# EAGLE schematic AnalogEx_1RedLedFadeInFadeOutUSB (EAGLE 7.6.0)
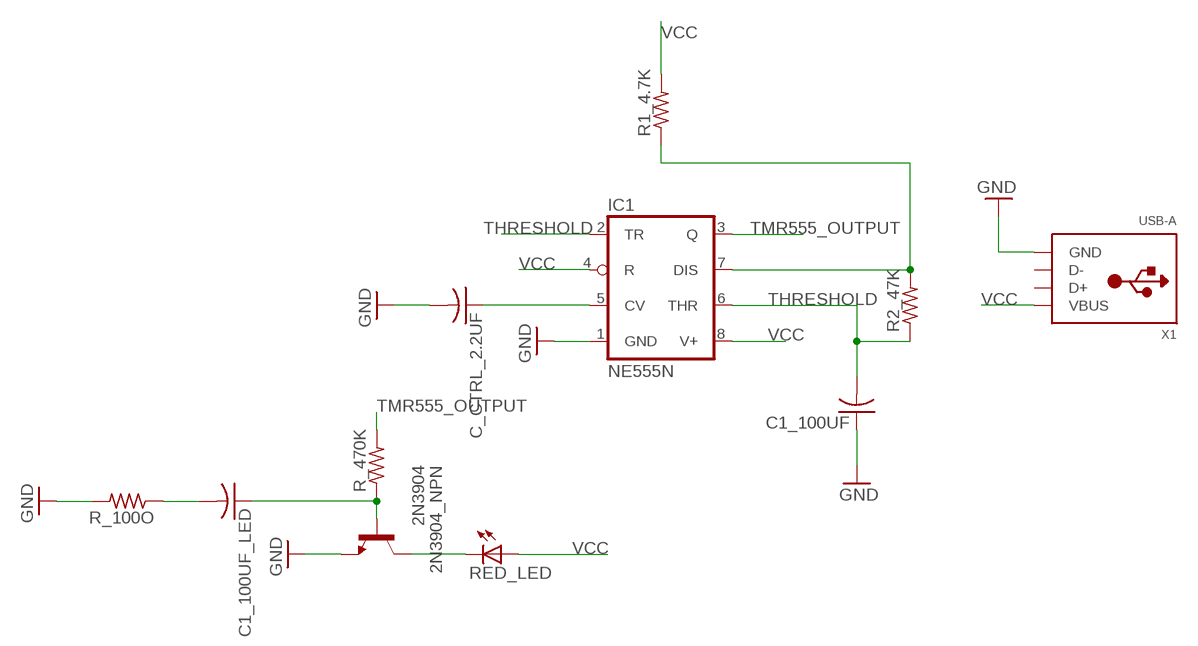
[diagram p0: schematic, sheet 1]

## Parts
2N3904_NPN  2N3904  [TO92]
C1_100UF  C-US025-030X050  [C025-030X050]
C1_100UF_LED  C-US025-030X050  [C025-030X050]
C_CTRL_2.2UF  C-US025-030X050  [C025-030X050]
IC1  NE555N  [DIL08]
R1_4.7K  R-US_0207/10  [0207/10]
R2_47K  R-US_0207/10  [0207/10]
R_100O  R-US_0207/10  [0207/10]
R_470K  R-US_0207/10  [0207/10]
RED_LED  LED5MM  [LED5MM]
X1  USB-A  [MOLEX_480371000]

## Nets
GND: 2N3904_NPN.3(E) C1_100UF.1 C_CTRL_2.2UF.2 IC1.1(GND) R_100O.2 X1.4(GND)
N$1: IC1.7(DIS) R1_4.7K.1 R2_47K.2
N$2: C_CTRL_2.2UF.1 IC1.5(CV)
N$3: 2N3904_NPN.2(B) C1_100UF_LED.1 R_470K.1
N$4: 2N3904_NPN.1(C) RED_LED.K(C)
N$5: C1_100UF_LED.2 R_100O.1
THRESHOLD: C1_100UF.2 IC1.2(TR) IC1.6(THR) R2_47K.1
TMR555_OUTPUT: IC1.3(Q) R_470K.2
VCC: IC1.4(R) IC1.8(V+) R1_4.7K.2 RED_LED.A X1.1(VBUS)
Unconnected: X1.2(D-) X1.3(D+)

## Library data of the parts
2N3904_NPN = transistor:2N3904: NPN TRANSISTOR
C1_100UF C1_100UF_LED C_CTRL_2.2UF = adafruit:C-US: CAPACITOR, American symbol
IC1 = linear:*555: TIMER
R1_4.7K R2_47K R_100O R_470K = adafruit:R-US_: RESISTOR, American symbol
RED_LED = adafruit:LED: LED OSRAM: - CHIPLED LG R971, LG N971, LY N971, LG Q971, LY Q971, LO R971, LY R971 LH N974, LH R974 LS Q976, LO Q976, LY Q976 LO Q996 - Hyper CHIPLED LW Q18S LB Q993, LB Q99A, LB R99A - SideLED LS A670, LO A670, LY A670, LG A670, LP A670 LB A673, LV A673, LT A673, LW A673 LH A674 LY A675 LS A676, LA A676, LO A676, LY A676, LW A676 LS A679, LY A679, LG A679 - Hyper Micro SIDELED® LS Y876, LA Y876, LO Y876, LY Y876 LT Y87S - SmartLED LW L88C, LW L88S LB L89C, LB L89S, LG L890 LS L89K, LO L89K, LY L89K LS L896, LA L896, LO L896, LY L896 - TOPLED LS T670, LO T670, LY T670, LG T670, LP T670 LSG T670, LSP T670, LSY T670, LOP T670, LYG T670 LG T671, LOG T671, LSG T671 LB T673, LV T673, LT T673, LW T673 LH T674 LS T676, LA T676, LO T676, LY T676, LB T676, LH T676, LSB T676, LW T676 LB T67C, LV T67C, LT T67C, LS T67K, LO T67K, LY T67K, LW E67C LS E67B, LA E67B, LO E67B, LY E67B, LB E67C, LV E67C, LT E67C LW T67C LS T679, LY T679, LG T679 LS T770, LO T770, LY T770, LG T770, LP T770 LB T773, LV T773, LT T773, LW T773 LH T774 LS E675, LA E675, LY E675, LS T675 LS T776, LA T776, LO T776, LY T776, LB T776 LHGB T686 LT T68C, LB T68C - Hyper Mini TOPLED® LB M676 - Mini TOPLED Santana® LG M470 LS M47K, LO M47K, LY M47K Source: http://www.osram.convergy.de/
X1 = adafruit:USB-A: USB type A 'plug' Used for things that can directly connect to a USB port, say USB key